# EAGLE design awm661tx (EAGLE 6.5.0)
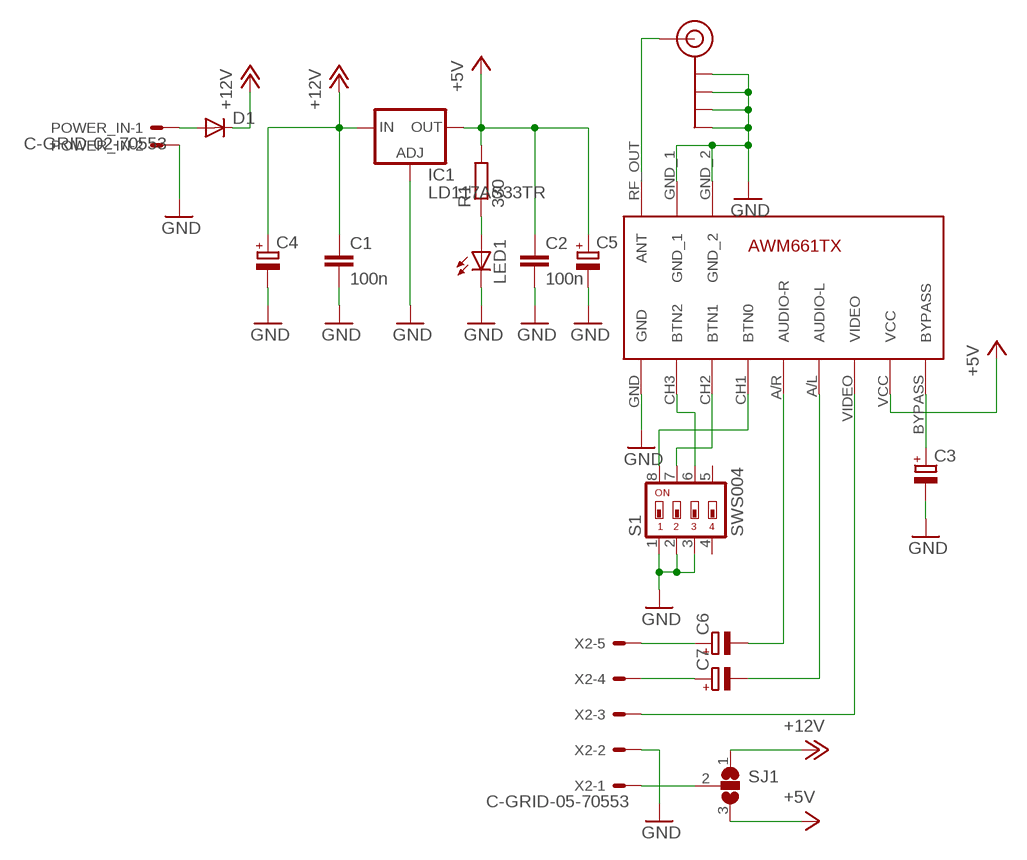
[diagram p0: schematic, sheet 1]

## Parts
C1  100n  C-EUC0805  [C0805]
C2  100n  C-EUC0805  [C0805]
C3  CPOL-EU150CLZ-0810  [150CLZ-0810]
C4  CPOL-EU150CLZ-0810  [150CLZ-0810]
C5  CPOL-EU150CLZ-0810  [150CLZ-0810]
C6  CPOL-EU153CLV-0505  [153CLV-0505]
C7  CPOL-EU153CLV-0505  [153CLV-0505]
D1  DIODE-MELF-MLL41  [MELF-MLL41]
IC1  LD117AS33TR  [SOT223]
J$1  SMA_EDGE  [SMA-EDGE]
LED1  LEDCHIP-LED0805  [CHIP-LED0805]
POWER_IN  C-GRID-02-70553  [70553-02]
R1  330  R-EU_R0805  [R0805]
S1  SWS004  [SMS-004]
SJ1  SJ2W  [SJ_2]
U$1  AWM661TX  [AWM661TX]
X2  C-GRID-05-70553  [70553-05]

## Nets
+5V: C2.1 C5.+ IC1.4(OUT) R1.2 SJ1.3 U$1.VCC
+12V: C1.1 C4.+ D1.C IC1.3(IN) SJ1.1
GND: C1.2 C2.2 C3.- C4.- C5.- IC1.1(ADJ) J$1.GND@0(GND) J$1.GND@1(GND) J$1.GND@2(GND) J$1.GND@3(GND) LED1.C POWER_IN.2 S1.1 S1.2 S1.3 U$1.GND U$1.GND_1 U$1.GND_2 X2.2
N$1: D1.A POWER_IN.1
N$2: LED1.A R1.1
N$3: J$1.SIG(SIGNAL) U$1.RF_OUT(ANT)
N$4: S1.7 U$1.CH2(BTN1)
N$5: S1.6 U$1.CH3(BTN2)
N$6: S1.8 U$1.CH1(BTN0)
N$9: C6.+ X2.5
N$10: C6.- U$1.A/R(AUDIO-R)
N$11: C7.- U$1.A/L(AUDIO-L)
N$12: C7.+ X2.4
N$13: U$1.VIDEO X2.3
N$15: C3.+ U$1.BYPASS
N$16: SJ1.2 X2.1
Unconnected: S1.4 S1.5

## Library data of the parts
C1 C2 = rcl:C-EU: CAPACITOR, European symbol
C3-C7 = rcl:CPOL-EU: POLARIZED CAPACITOR, European symbol
D1 = diode:DIODE-: DIODE
IC1 = v-reg:LD117A?*: Low drop fixed and adjustable positive voltage regulators 1 A Source: http://www.st.com/stonline/products/literature/ds/7194/ld1117axx.pdf
J$1 = SparkFun-Connectors:SMA_EDGE: SMA Antenna Connector End launch SMA connector. The paste layer has been removed so that the connector can be hand soldered onto the board after reflow.
LED1 = led:LED: LED OSRAM: - CHIPLED LG R971, LG N971, LY N971, LG Q971, LY Q971, LO R971, LY R971 LH N974, LH R974 LS Q976, LO Q976, LY Q976 LO Q996 - Hyper CHIPLED LW Q18S LB Q993, LB Q99A, LB R99A - SideLED LS A670, LO A670, LY A670, LG A670, LP A670 LB A673, LV A673, LT A673, LW A673 LH A674 LY A675 LS A676, LA A676, LO A676, LY A676, LW A676 LS A679, LY A679, LG A679 - Hyper Micro SIDELED® LS Y876, LA Y876, LO Y876, LY Y876 LT Y87S - SmartLED LW L88C, LW L88S LB L89C, LB L89S, LG L890 LS L89K, LO L89K, LY L89K LS L896, LA L896, LO L896, LY L896 - TOPLED LS T670, LO T670, LY T670, LG T670, LP T670 LSG T670, LSP T670, LSY T670, LOP T670, LYG T670 LG T671, LOG T671, LSG T671 LB T673, LV T673, LT T673, LW T673 LH T674 LS T676, LA T676, LO T676, LY T676, LB T676, LH T676, LSB T676, LW T676 LB T67C, LV T67C, LT T67C, LS T67K, LO T67K, LY T67K, LW E67C LS E67B, LA E67B, LO E67B, LY E67B, LB E67C, LV E67C, LT E67C LW T67C LS T679, LY T679, LG T679 LS T770, LO T770, LY T770, LG T770, LP T770 LB T773, LV T773, LT T773, LW T773 LH T774 LS E675, LA E675, LY E675, LS T675 LS T776, LA T776, LO T776, LY T776, LB T776 LHGB T686 LT T68C, LB T68C - Hyper Mini TOPLED® LB M676 - Mini TOPLED Santana® LG M470 LS M47K, LO M47K, LY M47K Source: http://www.osram.convergy.de LUXEON: - LUMILED® LXK2-PW12-R00, LXK2-PW12-S00, LXK2-PW14-U00, LXK2-PW14-V00 LXK2-PM12-R00, LXK2-PM12-S00, LXK2-PM14-U00 LXK2-PE12-Q00, LXK2-PE12-R00, LXK2-PE12-S00, LXK2-PE14-T00, LXK2-PE14-U00 LXK2-PB12-K00, LXK2-PB12-L00, LXK2-PB12-M00, LXK2-PB14-N00, LXK2-PB14-P00, LXK2-PB14-Q00 LXK2-PR12-L00, LXK2-PR12-M00, LXK2-PR14-Q00, LXK2-PR14-R00 LXK2-PD12-Q00, LXK2-PD12-R00, LXK2-PD12-S00 LXK2-PH12-R00, LXK2-PH12-S00 LXK2-PL12-P00, LXK2-PL12-Q00, LXK2-PL12-R00 Source: www.luxeon.com KINGBRIGHT: KA-3528ASYC Source: www.kingbright.com
POWER_IN = con-molex:C-GRID-02: CONNECTOR wire to board 2.54 mm (0.100") pitch header; OC_FARNELL: unknown; OC_NEWARK: unknown
R1 = rcl:R-EU_: RESISTOR, European symbol
S1 = smd-special:SWS004: SMD Dip Switch 4 pol.
SJ1 = jumper:SJ2W: SMD solder JUMPER
U$1 = n39:AWM661TX
X2 = con-molex:C-GRID-05: CONNECTOR wire to board 2.54 mm (0.100") pitch header; OC_FARNELL: unknown; OC_NEWARK: unknown

## Board
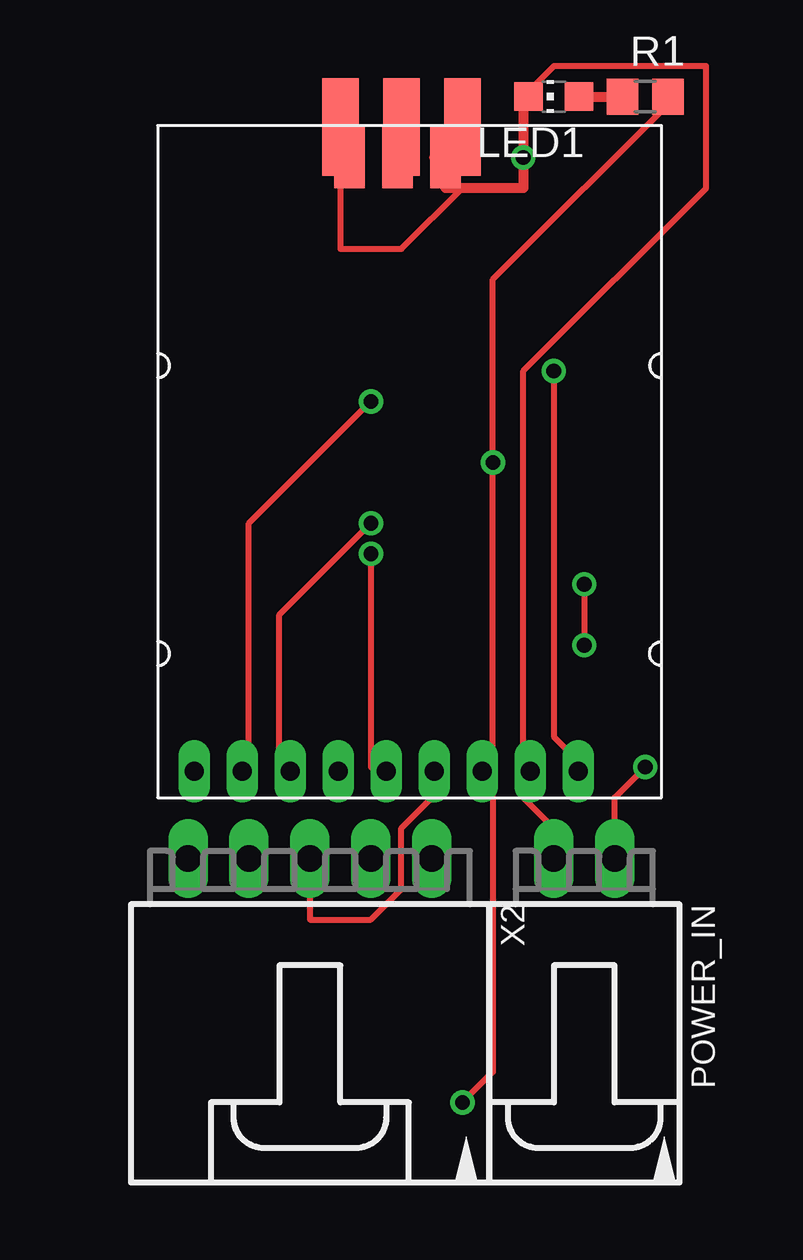
[diagram p1: board, top side]
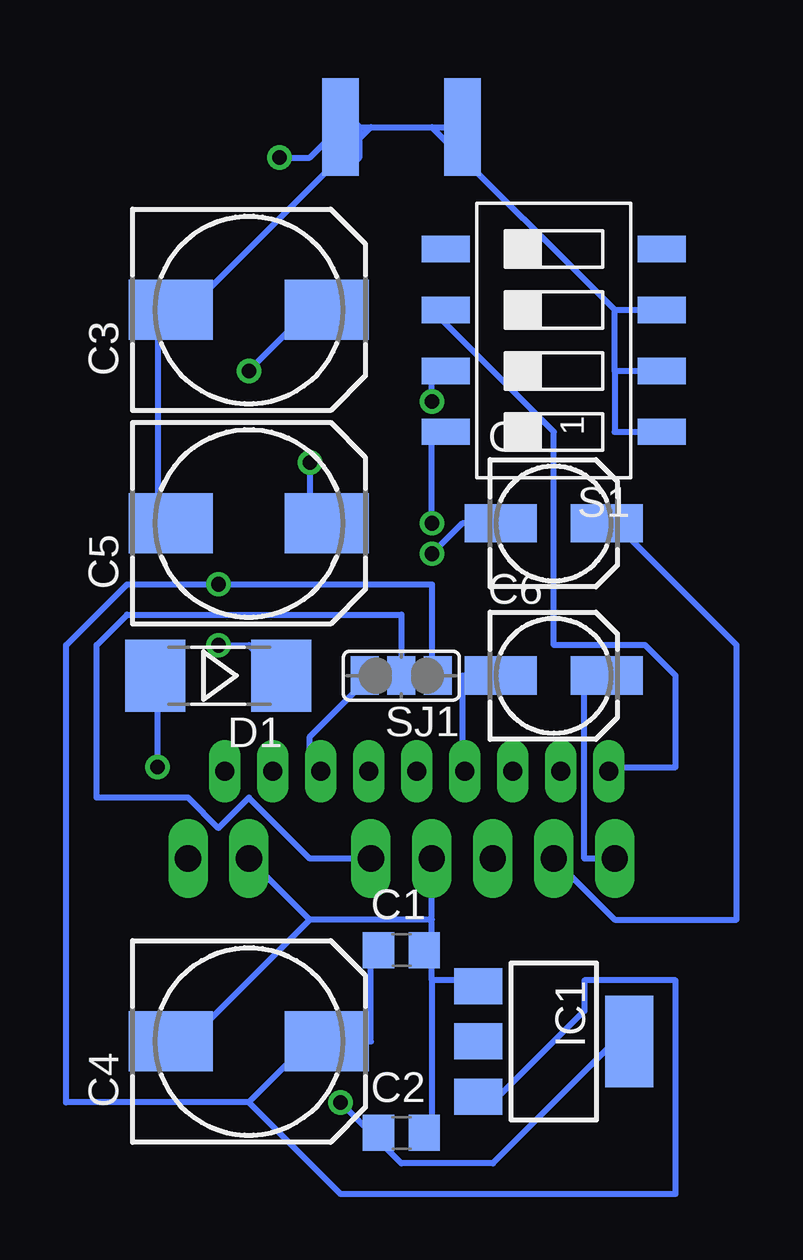
[diagram p2: board, bottom side, seen from below]

No outline drawn. Coordinates in mm, seen from the top.
Copper layers (1*16): Top 0.035mm / dielectric 1.5mm / Bottom 0.035mm
Design rules "default": minimum track width 10mil, minimum drill 24mil, track to track 8mil, track to pad 8mil, pad to pad 8mil, via to via 8mil, smd to smd 8mil, copper to edge 40mil, drill to drill 8mil, minimum pad ring 10mil, minimum via ring 8mil, stop-mask expansion 4mil, vias tented up to drill 0mil, thermal gap 10mil

### Footprints (pad centres in the part's own frame; a part is rotated, then mirrored left to right if it is on the bottom)
C0805 = smd 1.3 x 1.5: 1 -0.95,0; 2 0.95,0
150CLZ-0810 = smd 3.5 x 2.5: + 3.25,0; - -3.25,0
153CLV-0505 = smd 3 x 1.6: + 2.2,0; - -2.2,0
MELF-MLL41 = smd 2.5 x 3: A 2.625,0; C -2.625,0
SOT223 = smd 1.5 x 2: 1 -2.3,-3.15; 2 0,-3.15; 3 2.3,-3.15 | smd 3.8 x 2: 4 0,3.15
SMA-EDGE = smd 1.524 x 4.064: GND@0 0,0; GND@1 5.08,0; SIG 2.54,0 | smd 1.524 x 4.064 bottom: GND@2 0,0; GND@3 5.08,0
CHIP-LED0805 = smd 1.2 x 1.2: A 0,-1.05; C 0,1.05
70553-02 = drill 1.092 long: 1 -1.27,-7.62; 2 1.27,-7.62
R0805 = smd 1.3 x 1.5: 1 -0.95,0; 2 0.95,0
SMS-004 = smd 1.092 x 2.007: 1 -3.81,-4.496; 2 -1.27,-4.496; 3 1.27,-4.496; 4 3.81,-4.496; 5 3.81,4.496; 6 1.27,4.496; 7 -1.27,4.496; 8 -3.81,4.496
SJ_2 = smd 1.168 x 1.6: 1 -1.524,0; 2 0,0; 3 1.524,0
AWM661TX = drill 0.8 long: A/L 9.525,1.1; A/R 7.525,1.1; BYPASS 17.525,1.1; CH1 5.525,1.1; CH2 3.525,1.1; CH3 1.525,1.1; GND 15.525,1.1; VCC 13.525,1.1; VIDEO 11.525,1.1 | smd 1.27 x 2.54: GND_1 8,26.67; GND_2 12,26.67; RF_OUT 10,26.67
70553-05 = drill 1.092 long: 1 -5.08,-7.62; 2 -2.54,-7.62; 3 0,-7.62; 4 2.54,-7.62; 5 5.08,-7.62

### Placement (x,y rotation side)
C1  11.43,10.16 0 bottom
C2  11.43,2.54 0 bottom
C3  17.78,36.83 0 bottom
C4  17.78,6.35 0 bottom
C5  17.78,27.94 0 bottom
C6  5.08,21.59 0 bottom
C7  5.08,27.94 0 bottom
D1  19.05,21.59 180 bottom
IC1  5.08,6.35 270 bottom
J$1  8.89,44.45 0 top
LED1  17.78,45.72 90 top
POWER_IN  19.05,6.35 180 top
R1  21.59,45.72 0 top
S1  5.08,35.56 90 bottom
SJ1  11.43,21.59 180 bottom
U$1  1.27,16.51 0 top
X2  7.62,6.35 180 top

### Tracks (layer width: path | path; a pad name or v marks a point on that pad's centre or on a via)
+5V  (via drill 0.61)
  Top 0.254: R1.2 22.86,45.72 15.24,38.1 v15.24,30.48 15.24,17.78 U$1.VCC 15.24,16.51 15.24,5.08 v13.97,3.81
  Bottom 0.254: 12.7,2.54 11.43,1.27 7.62,1.27 2.54,6.35 IC1.4 | SJ1.3 12.7,21.59 15.24,19.05 15.24,17.78 U$1.VCC | v15.24,30.48 15.24,27.94 C5.+ | v13.97,3.81 12.7,2.54 | 12.7,2.54 C2.1
+12V  (via drill 0.61)
  Top 0.254: v19.05,25.4 v19.05,22.86
  Bottom 0.254: C1.1 12.7,10.16 12.7,6.35 C4.+ 15.24,6.35 17.78,3.81 | 17.78,3.81 25.4,3.81 25.4,22.86 22.86,25.4 v19.05,25.4 10.16,25.4 10.16,21.59 SJ1.1 | 17.78,3.81 13.97,0 0,0 0,8.89 3.81,8.89 3.81,7.62 7.62,3.81 IC1.3 | v19.05,22.86 17.78,22.86 16.51,21.59 D1.C
GND  (via drill 0.61)
  Top 0.254: J$1.GND@3 12.7,43.18 U$1.GND_2 | 13.97,41.91 11.43,39.37 8.89,39.37 8.89,43.18 U$1.GND_1 | POWER_IN.2 17.78,15.24 16.51,16.51 U$1.GND 16.51,17.78 16.51,34.29 24.13,41.91 24.13,46.99 17.78,46.99 16.51,45.72
  Top 0.406: J$1.GND@2 9.27,44.45 U$1.GND_1 | LED1.C 16.51,45.72 v16.51,43.18 16.51,41.91 13.97,41.91 13.27,41.91 U$1.GND_2
  Bottom 0.254: C5.- 21.59,27.94 21.59,36.83 C3.- 20.32,36.83 12.7,44.45 | 2.54,34.29 2.54,31.75 S1.1 | 2.54,34.29 2.54,36.83 | 2.54,34.29 S1.2 | 10.16,44.45 2.54,36.83 | 12.7,44.45 J$1.GND@3 15.24,43.18 v16.51,43.18 | 12.7,44.45 10.16,44.45 | 2.54,36.83 S1.3 | 10.16,44.45 J$1.GND@2 | 10.16,8.89 10.16,2.54 C2.2 | 10.16,8.89 8.89,8.89 IC1.1 | 10.16,8.89 10.16,10.16 | 10.16,10.16 10.16,11.43 | 10.16,11.43 X2.2 | 10.16,10.16 C1.2 | 15.24,11.43 20.32,6.35 C4.- | 10.16,11.43 15.24,11.43 | 15.24,11.43 POWER_IN.2
  Bottom 0.406: J$1.GND@3 13.27,44.45 U$1.GND_2
N$1  (via drill 0.61)
  Top 0.254: v21.59,17.78 20.32,16.51 POWER_IN.1
  Bottom 0.254: v21.59,17.78 21.59,21.59 D1.A
N$2
  Top 0.406: LED1.A R1.1
N$3
  Top 0.254: J$1.SIG 11.43,43.18 U$1.RF_OUT
N$4  (via drill 0.61)
  Top 0.254: v10.16,33.02 5.08,27.94 5.08,17.78 U$1.CH2
  Bottom 0.254: v10.16,33.02 10.16,34.29 S1.7
N$5
  Bottom 0.254: S1.6 10.16,36.83 5.08,31.75 5.08,22.86 1.27,22.86 0,21.59 0,17.78 2.54,17.78 U$1.CH3
N$6  (via drill 0.61)
  Top 0.254: v10.16,27.94 6.35,24.13 6.35,17.78 U$1.CH1
  Bottom 0.254: v10.16,27.94 10.16,31.75 S1.8
N$9
  Bottom 0.254: X2.5 3.81,13.97 3.81,21.59 C6.+
N$10
  Bottom 0.254: C6.- 8.89,21.59 8.89,17.78 U$1.A/R
N$11  (via drill 0.61)
  Top 0.254: v10.16,26.67 10.16,17.78 U$1.A/L
  Bottom 0.254: v10.16,26.67 8.89,27.94 C7.-
N$12
  Bottom 0.254: X2.4 2.54,11.43 -2.54,11.43 -2.54,22.86 2.54,27.94 C7.+
N$13
  Top 0.254: X2.3 7.62,11.43 10.16,11.43 11.43,12.7 11.43,15.24 12.7,16.51 U$1.VIDEO
N$15  (via drill 0.61)
  Top 0.254: v17.78,34.29 17.78,19.05 19.05,17.78 U$1.BYPASS
  Bottom 0.254: v17.78,34.29 15.24,36.83 C3.+
N$16
  Bottom 0.254: SJ1.2 11.43,24.13 22.86,24.13 24.13,22.86 24.13,16.51 20.32,16.51 19.05,15.24 17.78,16.51 15.24,13.97 X2.1